# EAGLE schematic Main (EAGLE 9.1.3)
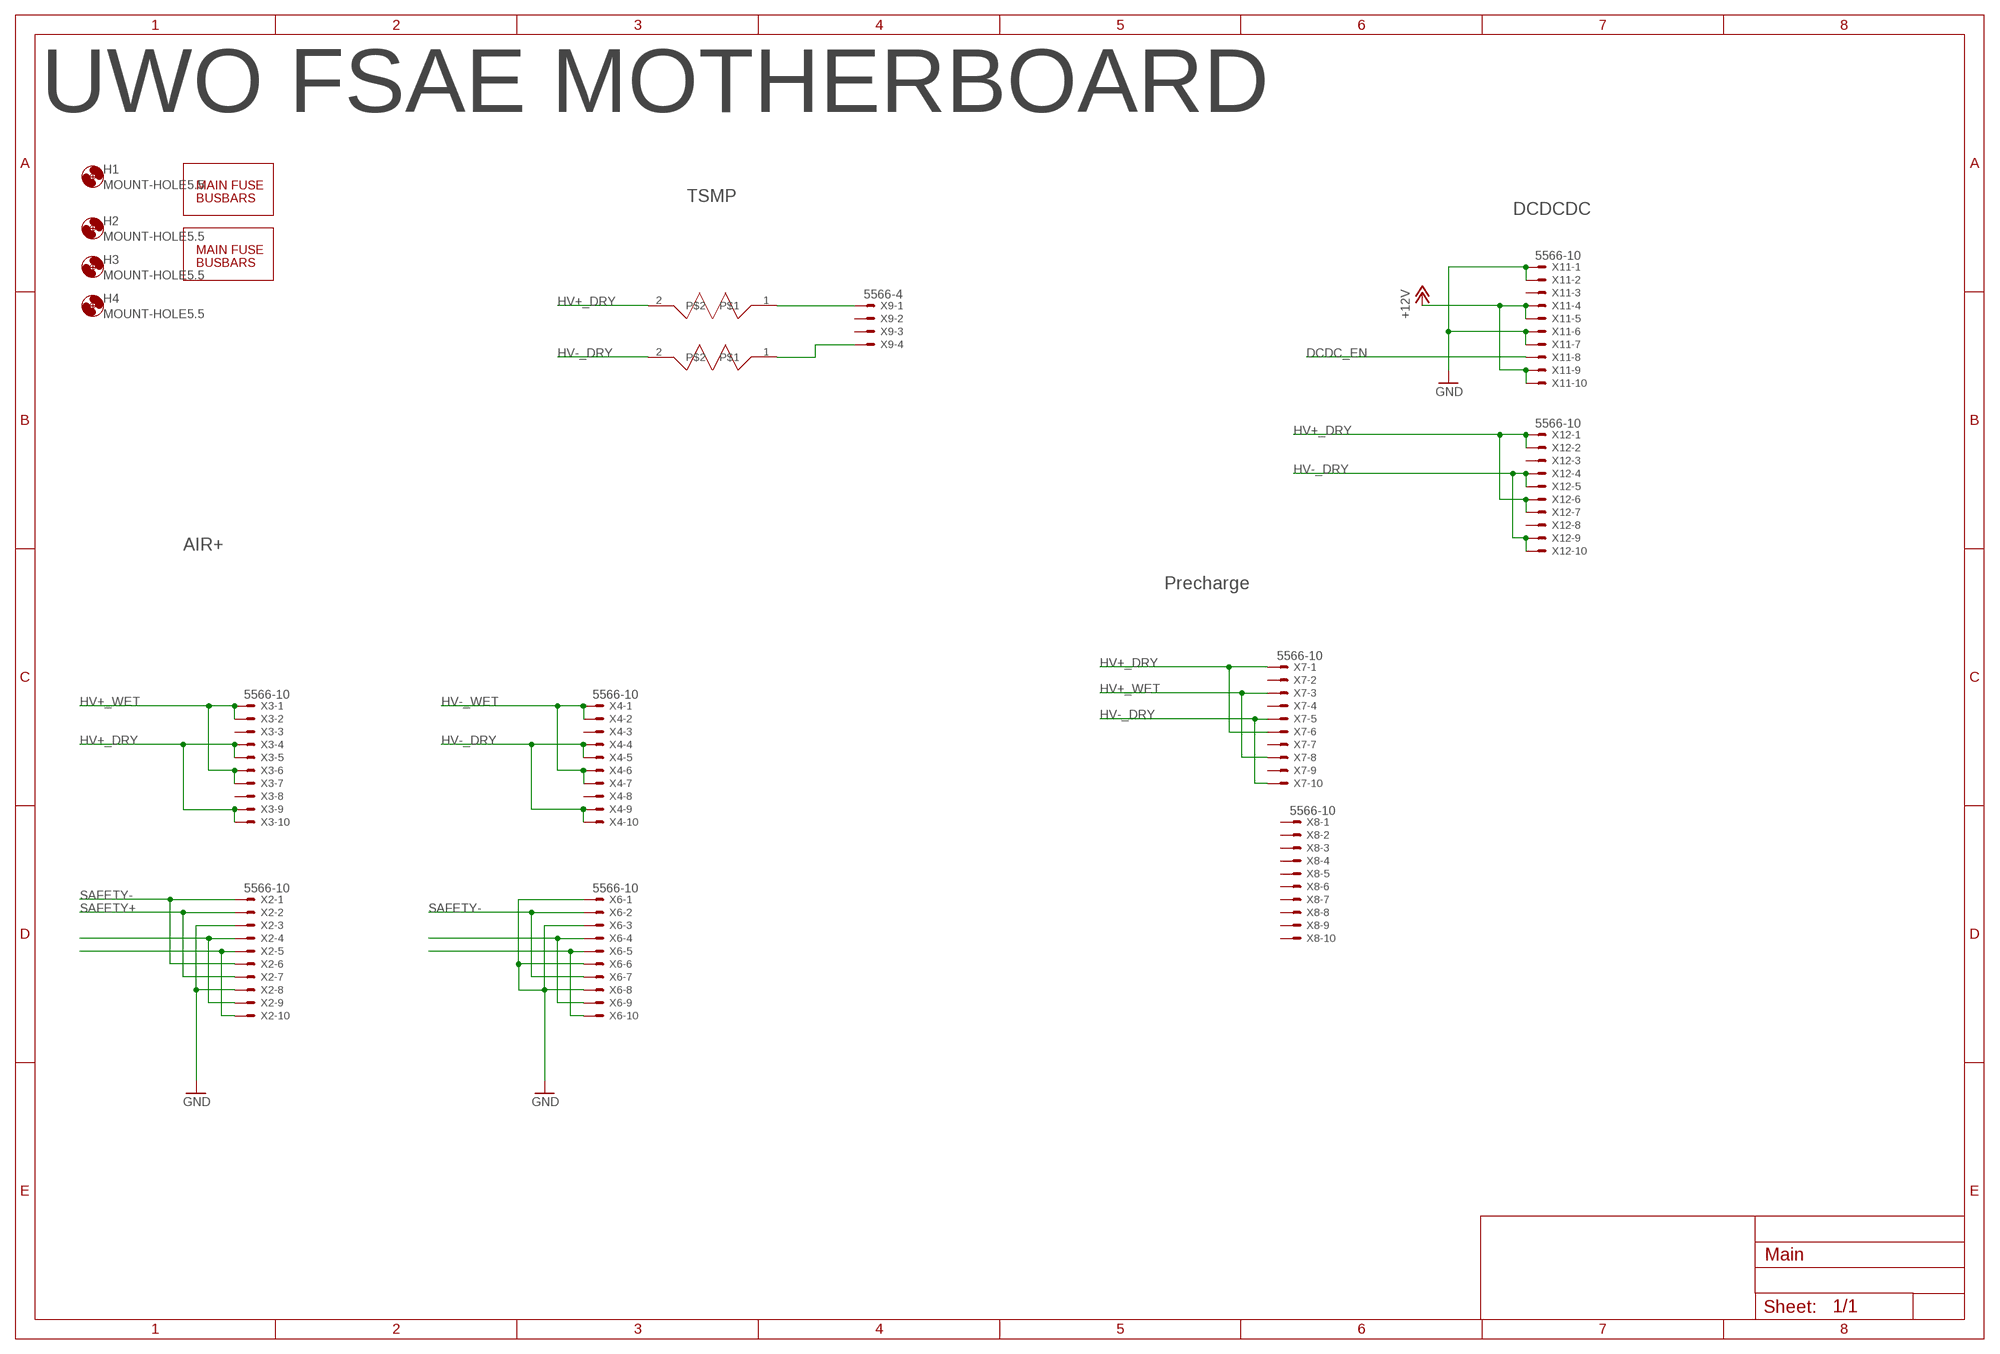
[diagram p0: schematic, sheet 1]

## Parts
H1  MOUNT-HOLE5.5  [5,5]
H2  MOUNT-HOLE5.5  [5,5]
H3  MOUNT-HOLE5.5  [5,5]
H4  MOUNT-HOLE5.5  [5,5]
U$1  FUSE_HOLDER  [FUSE_HOLDER]
U$2  FUSE_HOLDER  [FUSE_HOLDER]
U$3  TO247RESISTORHEATINK  [_CUSTOM_TO-247-2V]
U$5  TO247RESISTORHEATINK  [_CUSTOM_TO-247-2V]
X2  5566-10  [5566-10]
X3  5566-10  [5566-10]
X4  5566-10  [5566-10]
X6  5566-10  [5566-10]
X7  5566-10  [5566-10]
X8  5566-10  [5566-10]
X9  5566-4  [5566-4]
X11  5566-10  [5566-10]
X12  5566-10  [5566-10]

## Nets
+12V: X11.4 X11.5 X11.9 X11.10
DCDC_EN: X11.8
GND: X11.1 X11.2 X11.6 X11.7
HV+_DRY: U$5.2 X3.4 X3.5 X3.9 X3.10 X7.1 X7.6 X12.1 X12.2 X12.6 X12.7
HV+_WET: X3.1 X3.2 X3.6 X3.7 X7.3 X7.8
HV-_DRY: U$3.2 X4.4 X4.5 X4.9 X4.10 X7.5 X7.10 X12.4 X12.5 X12.9 X12.10
HV-_WET: X4.1 X4.2 X4.6 X4.7
N$3: X2.5 X2.10
N$4: X2.4 X2.9
N$6: X2.3 X2.8
N$23: U$5.1 X9.1
N$24: U$3.1 X9.4
N$25: X6.5 X6.10
N$26: X6.4 X6.9
N$29: X6.1 X6.3 X6.6 X6.8
SAFETY+: X2.2 X2.7
SAFETY-: X2.1 X2.6 X6.2 X6.7
Unconnected: X3.3 X3.8 X4.3 X4.8 X7.2 X7.4 X7.7 X7.9 X8.1 X8.2 X8.3 X8.4 X8.5 X8.6 X8.7 X8.8 X8.9 X8.10 X9.2 X9.3 X11.3 X12.3 X12.8

## Notes on the sheet
- UWO FSAE MOTHERBOARD
- TSMP
- DCDCDC
- AIR+
- Precharge

## Library data of the parts
H1-H4 = Main:MOUNT-HOLE: MOUNTING HOLE with drill center marker
U$1 U$2 = Main:FUSE_HOLDER
U$3 U$5 = ACC-MB-R0:TO247RESISTORHEATINK; PACKAGE: TO-247
X2-X4 X6-X8 X11 X12 = con-molex:5566-10: Mini FIT connector 10 pol Source: http://www.molex.com; MF: MOLEX; OC_FARNELL: unknown; OC_NEWARK: unknown
X9 = con-molex:5566-4: Mini FIT connector 4 pol Source: http://www.molex.com; MF: MOLEX; OC_FARNELL: unknown; OC_NEWARK: unknown

## Net classes
0 default: width 1 mm, clearance 0.152 mm
1 LV: clearance 0.001 mm